# EAGLE design rc (1) (EAGLE 9.6.2)
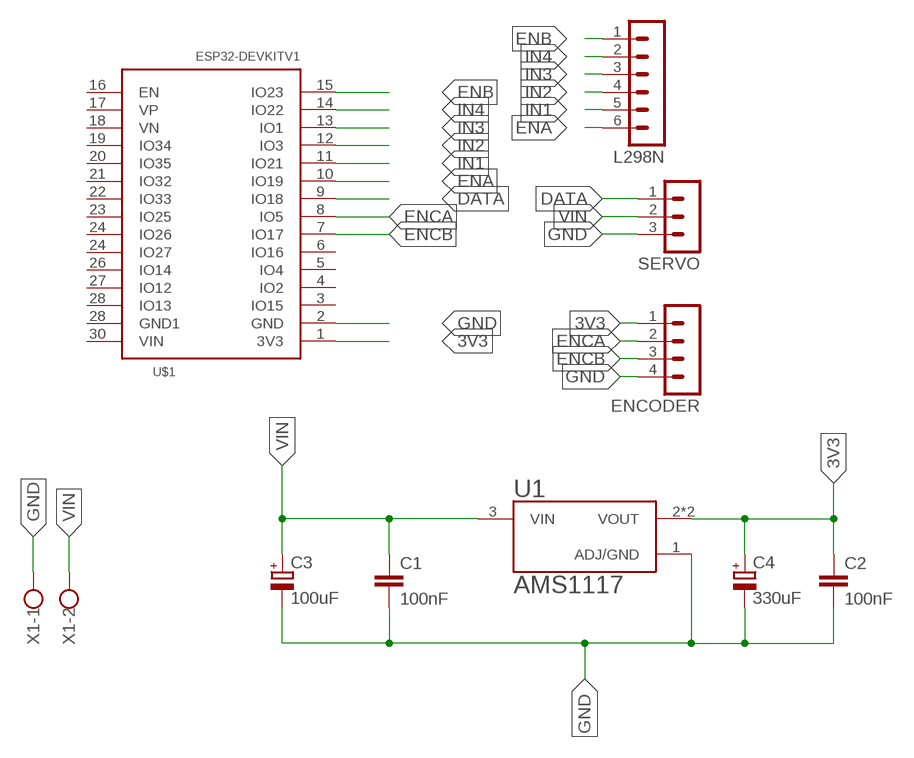
[diagram p0: schematic, sheet 1]

## Parts
C1  100nF  C-EUC0805  [C0805]
C2  100nF  C-EUC0805  [C0805]
C3  100uF  CPOL-EUCT6032  [CT6032]
C4  330uF  CPOL-EUCT6032  [CT6032]
ENCODER  MA04-1  [MA04-1]
L298N  MA06-1  [MA06-1]
SERVO  MA03-1  [MA03-1]
U1  AMS1117  [SOT229P700X180-4N]
U$1  ESP32DEVKITV1  [ESP32-DEVKITV1]
X1  W237-102  [W237-102]

## Nets
3V3: C2.1 C4.+ ENCODER.1 U1.2(VOUT) U1.4(VOUT) U$1.1(3V3)
DATA: SERVO.1 U$1.9(IO18)
ENA: L298N.6 U$1.10(IO19)
ENB: L298N.1 U$1.15(IO23)
ENCA: ENCODER.2 U$1.8(IO5)
ENCB: ENCODER.3 U$1.7(IO17)
GND: C1.2 C2.2 C3.- C4.- ENCODER.4 SERVO.3 U1.1(ADJ/GND) U$1.2(GND) X1.1
IN1: L298N.5 U$1.11(IO21)
IN2: L298N.4 U$1.12(IO3)
IN3: L298N.3 U$1.13(IO1)
IN4: L298N.2 U$1.14(IO22)
VIN: C1.1 C3.+ SERVO.2 U1.3(VIN) X1.2
Unconnected: U$1.3(IO15) U$1.4(IO2) U$1.5(IO4) U$1.6(IO16) U$1.16(EN) U$1.17(VP) U$1.18(VN) U$1.19(IO34) U$1.20(IO35) U$1.21(IO32) U$1.22(IO33) U$1.23(IO25) U$1.24(IO26) U$1.24(IO27) U$1.26(IO14) U$1.27(IO12) U$1.28(GND1) U$1.28(IO13) U$1.30(VIN)

## Library data of the parts
C1 C2 = rcl:C-EU: CAPACITOR, European symbol; SPICEPREFIX: C
C3 C4 = rcl:CPOL-EU: POLARIZED CAPACITOR, European symbol; SPICEPREFIX: C
ENCODER = con-lstb:MA04-1: PIN HEADER; OC_FARNELL: unknown; OC_NEWARK: unknown
L298N = con-lstb:MA06-1: PIN HEADER; OC_FARNELL: unknown; OC_NEWARK: unknown
SERVO = con-lstb:MA03-1: PIN HEADER; OC_FARNELL: unknown; OC_NEWARK: unknown
U1 = AMS1117:AMS1117: Sot223/Pkg 1-Amp 5-Volt Low Drop Out Voltage Regulatator Check prices <https://pricing.snapeda.com/parts/AMS1117/Advanced%20Monolithic%20Systems/view-part?ref=eda>; AVAILABILITY: No availability data; DESCRIPTION: 1A LOW DROPOUT VOLTAGE REGULATOR SOT-223; MF: Advanced Monolithic Systems; MP: AMS1117; PACKAGE: SOT-223 Seeed Technology; PRICE: None
U$1 = ESP32-DEVKITV1:ESP32DEVKITV1
X1 = con-wago-500:W237-102: WAGO SCREW CLAMP; MPN: 237-102; OC_FARNELL: unknown; OC_NEWARK: 70K9898

## Board
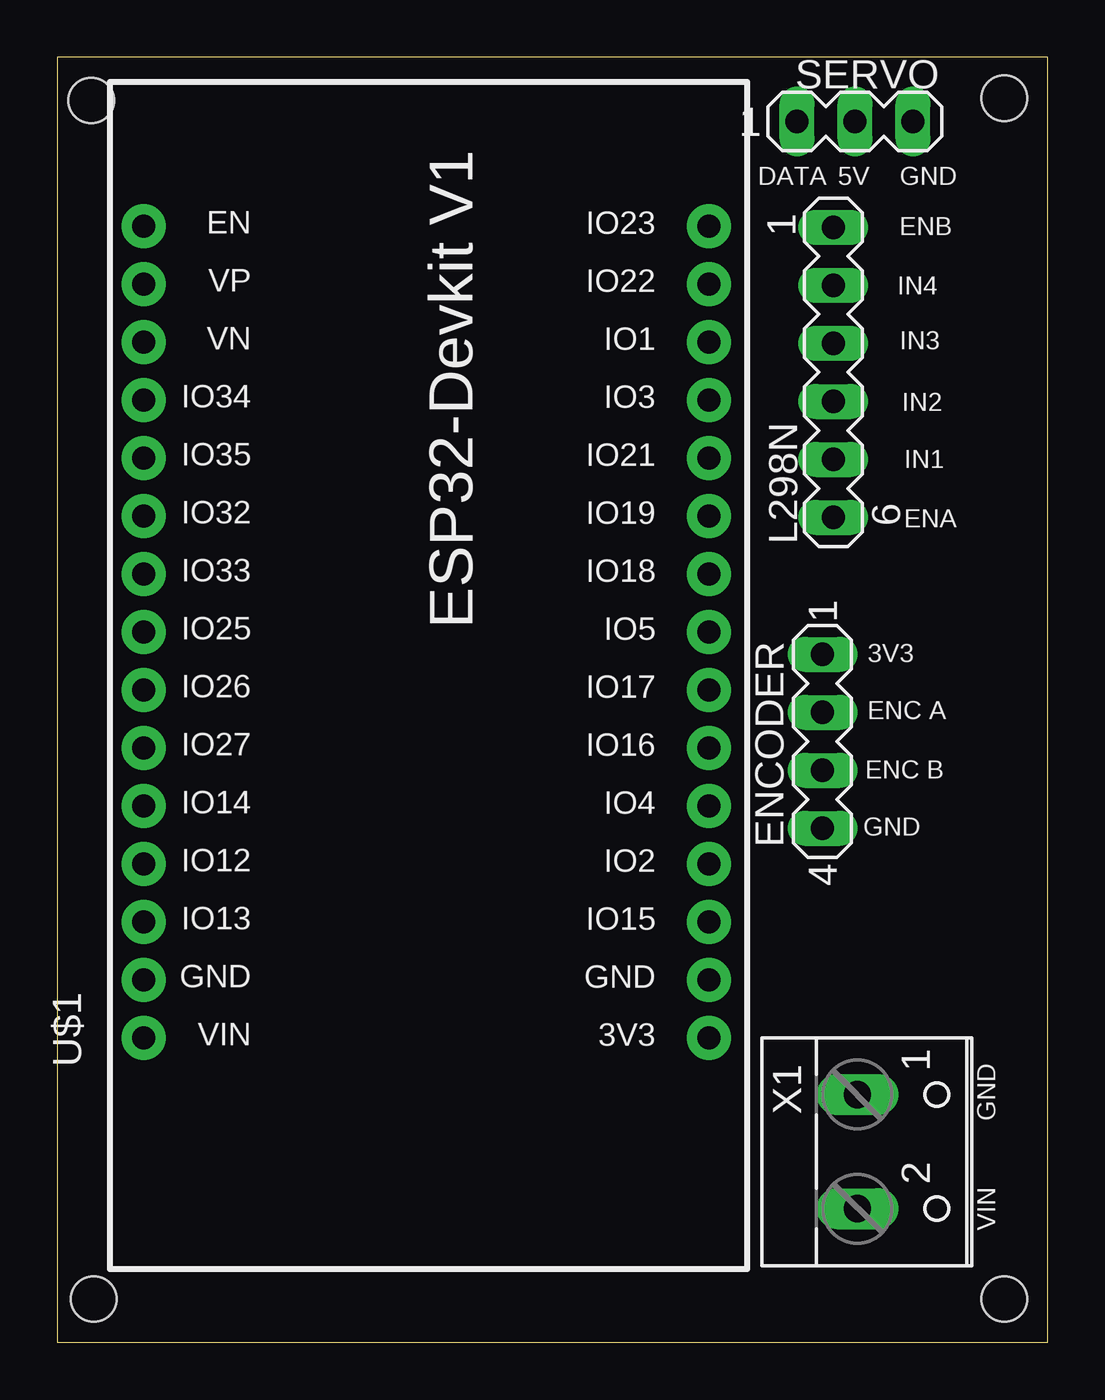
[diagram p1: board, top side]
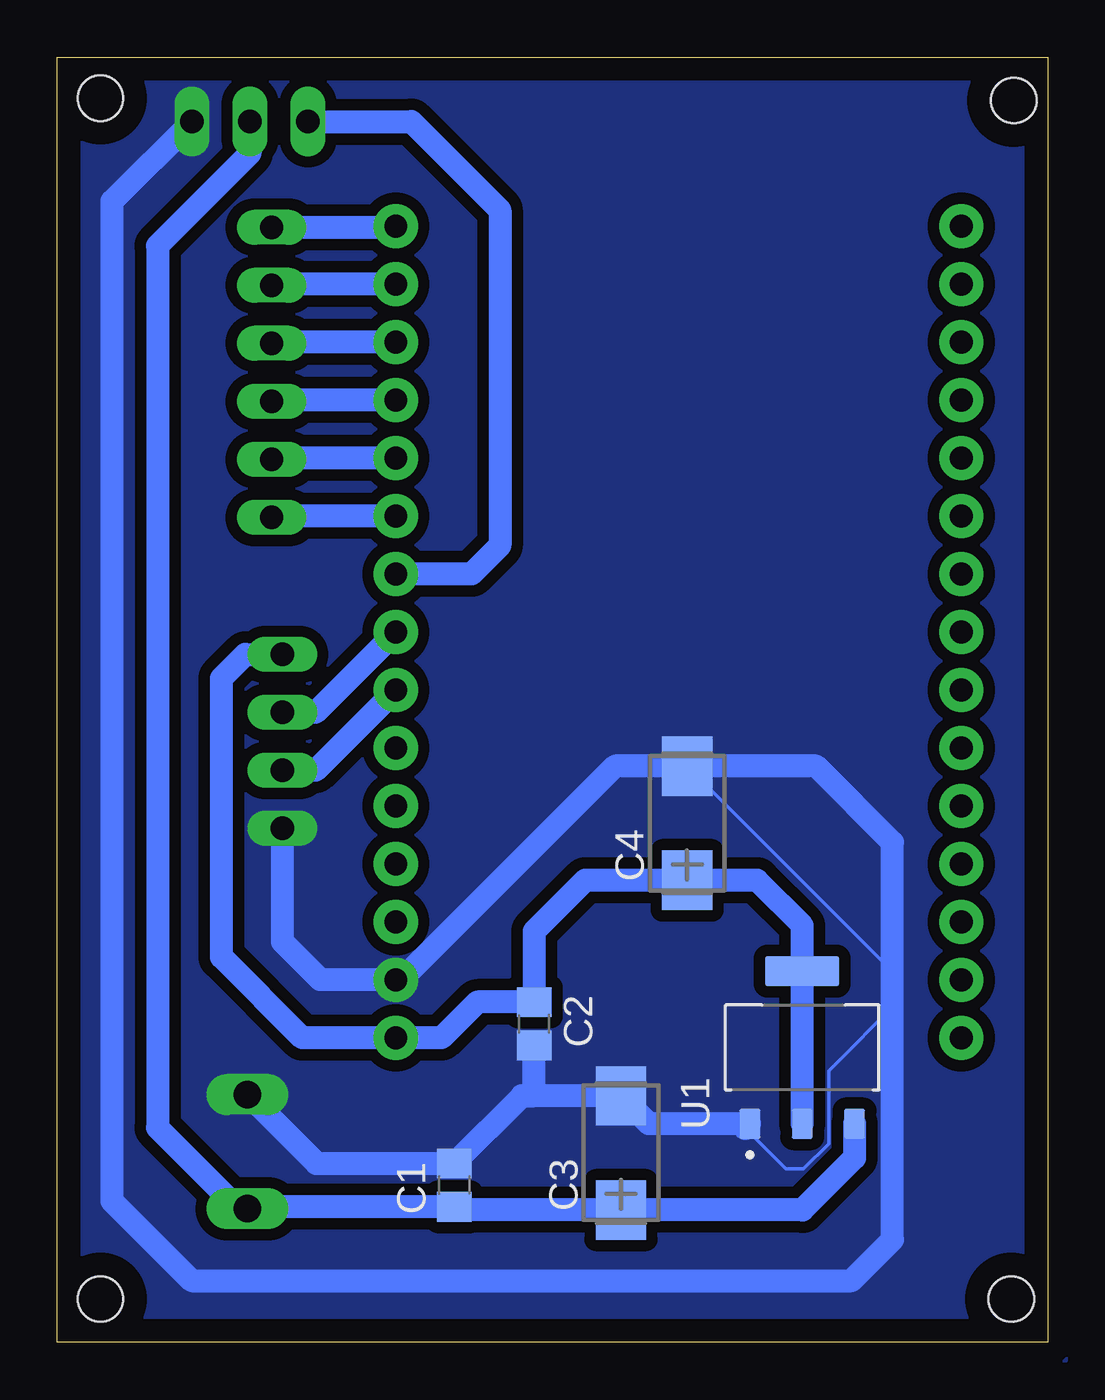
[diagram p2: board, bottom side, seen from below]

Size 43.4 x 56.3 mm. Coordinates in mm from the lower left corner, seen from the top.
Outline: 0,0 43.4,0 43.4,56.3 0,56.3 0,0
Copper layers (1*16): Top 0.035mm / dielectric 1.5mm / Bottom 0.035mm
Design rules "default": minimum track width 6mil, minimum drill 0.35mm, track to track 6mil, track to pad 6mil, pad to pad 6mil, via to via 6mil, smd to smd 6mil, copper to edge 40mil, drill to drill 6mil, minimum pad ring 10mil, minimum via ring 8mil, stop-mask expansion 4mil, vias tented up to drill 0mil, thermal gap 10mil
Holes 2 mm at 1.6,1.9 41.5,1.9 1.5,54.4 41.5,54.5

### Footprints (pad centres in the part's own frame; a part is rotated, then mirrored left to right if it is on the bottom)
C0805 = smd 1.3 x 1.5: 1 -0.95,0; 2 0.95,0
CT6032 = smd 2.6 x 2.2: + -2.5,0; - 2.5,0
MA04-1 = drill 1.016 long: 1 -3.81,0; 2 -1.27,0; 3 1.27,0; 4 3.81,0
MA06-1 = drill 1.016 long: 1 -6.35,0; 2 -3.81,0; 3 -1.27,0; 4 1.27,0; 5 3.81,0; 6 6.35,0
MA03-1 = drill 1.016 long: 1 -2.54,0; 2 0,0; 3 2.54,0
SOT229P700X180-4N = smd 1.31 x 0.93: 1 -3.345,2.29; 2 -3.345,0; 3 -3.345,-2.29 | smd 1.31 x 3.24: 4 3.345,0
ESP32-DEVKITV1 = drill 1 pad 1.93: 1 -22.87,-13.54; 2 -20.33,-13.54; 3 -17.79,-13.54; 4 -15.25,-13.54; 5 -12.71,-13.54; 6 -10.17,-13.54; 7 -7.63,-13.54; 8 -5.09,-13.54; 9 -2.55,-13.54; 10 -0.01,-13.54; 11 2.53,-13.54; 12 5.07,-13.54; 13 7.61,-13.54; 14 10.15,-13.54; 15 12.69,-13.54; 16 12.69,11.23; 17 10.15,11.23; 18 7.61,11.23; 19 5.07,11.23; 20 2.53,11.23; 21 -0.01,11.23; 22 -2.55,11.23; 23 -5.09,11.23; 24 -7.63,11.23; 25 -10.17,11.23; 26 -12.71,11.23; 27 -15.25,11.23; 28 -17.79,11.23; 29 -20.33,11.23; 30 -22.87,11.23
W237-102 = drill 1.194 long: 1 -2.5,-1.27; 2 2.5,-1.27

### Placement (x,y rotation side)
C1  26,6.89 90 bottom
C2  22.5,13.96 270 bottom
C3  18.7,8.3 90 bottom
C4  15.8,22.74 90 bottom
ENCODER  33.53,26.33 270 top
L298N  34,42.49 270 top
SERVO  34.95,53.48 0 top
U1  10.76,12.92 90 bottom
U$1  15.02,36.21 90 top
X1  36.33,8.36 270 top

### Tracks (layer width: path | path; a pad name or v marks a point on that pad's centre or on a via)
3V3
  Bottom 1.016: U1.2 U1.4 10.76,18.27 12.74,20.24 C4.+ 20.27,20.24 22.5,18.01 C2.1 24.99,14.91 26.56,13.34 U$1.1 32.66,13.34 36.2,16.88 36.2,29.1 35.16,30.14 ENCODER.1
DATA
  Bottom 1.016: SERVO.1 27.88,53.48 24,49.6 24,34.9 25.24,33.66 U$1.9
ENA
  Bottom 1.016: U$1.10 33.94,36.2 L298N.6
ENB
  Bottom 1.016: L298N.1 28.62,48.84 U$1.15
ENCA
  Bottom 1.016: U$1.8 32.08,27.6 ENCODER.2
ENCB
  Bottom 1.016: U$1.7 32.08,25.06 ENCODER.3
GND
  Bottom 0.152: 15.8,24.7 C4.- 6.5,15.94 6.5,15 9.6,11.9 9.6,8.7 10.7,7.6 11.47,7.6 13.25,9.38
  Bottom 1.016: 13.25,9.38 U1.1 17.47,9.57 C3.- 22.5,10.8 | 22.5,10.8 23.04,10.8 C1.2 32.04,7.84 X1.1 | 22.5,10.8 C2.2 | ENCODER.4 33.53,17.55 31.86,15.88 U$1.2 28.44,15.76 18.96,25.24 C4.- 10.14,25.24 6.8,21.9 6.8,4.5 8.6,2.7 37.5,2.7 41,6.2 41,50 40.97,50 SERVO.3
  pour Bottom (isolate 0.5, no thermals): -0.6,56.9 44.1,56.9 44.2,56.8 44.2,-0.6 44,-0.8 -0.8,-0.8 -0.8,56.7 -0.5,56.7 -0.4,56.8
IN1
  Bottom 1.016: U$1.11 33.94,38.74 L298N.5
IN2
  Bottom 1.016: U$1.12 33.94,41.28 L298N.4
IN3
  Bottom 1.016: U$1.13 33.94,43.82 L298N.3
IN4
  Bottom 1.016: U$1.14 33.94,46.36 L298N.2
VIN
  Bottom 1.016: 34.98,5.94 C1.1 25.86,5.8 C3.+ 10.75,5.8 8.47,8.07 U1.3 | 34.98,5.94 X1.2 | SERVO.2 34.95,52.08 39,48.03 39,9.4 35.54,5.94 34.98,5.94

### Text on the board
tNames: DATA | 5V | GND | ENB | IN4 | IN3 | IN2 | IN1 | ENA | 3V3 | ENC A | ENC B | GND | GND | VIN